# EAGLE schematic atx_psu_distributor_v2.0 (EAGLE 6.4)
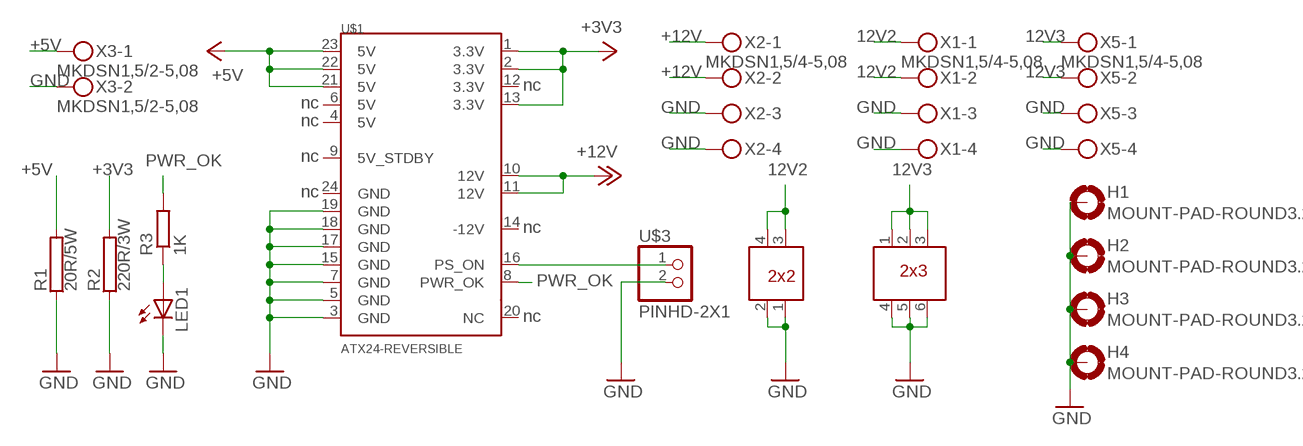
[diagram p0: schematic, sheet 1]

## Parts
H1  MOUNT-PAD-ROUND3.2  [3,2-PAD]
H2  MOUNT-PAD-ROUND3.2  [3,2-PAD]
H3  MOUNT-PAD-ROUND3.2  [3,2-PAD]
H4  MOUNT-PAD-ROUND3.2  [3,2-PAD]
LED1  LED3MM  [LED3MM]
R1  20R/5W  RHPS923  [HPS923]
R2  220R/3W  RCA4050  [CA4050]
R3  1K  R-EU_0207/10  [0207/10]
U$1  ATX24-REVERSIBLE  [ATX24]
U$2  ATX2X2  [ATX2X2]
U$3  PINHD-2X1  [PINHD-2X1]
U$4  ATX2X3  [ATX2X3]
X1  MKDSN1,5/4-5,08  [MKDSN1,5/4-5,08]
X2  MKDSN1,5/4-5,08  [MKDSN1,5/4-5,08]
X3  MKDSN1,5/2-5,08  [MKDSN1,5/2-5,08]
X5  MKDSN1,5/4-5,08  [MKDSN1,5/4-5,08]

## Nets
12V2: U$2.3 U$2.4 X1.1 X1.2
12V3: U$4.1 U$4.2 U$4.3 X5.1 X5.2
+3V3: R2.2 U$1.1(3.3V) U$1.2(3.3V) U$1.13(3.3V)
+5V: R1.2 U$1.21(5V) U$1.22(5V) U$1.23(5V) X3.1
+12V: U$1.10(12V) U$1.11(12V) X2.1 X2.2
GND: H1.B3,2(MOUNT) H2.B3,2(MOUNT) H3.B3,2(MOUNT) H4.B3,2(MOUNT) LED1.K(C) R1.1 R2.1 U$1.3(GND) U$1.5(GND) U$1.7(GND) U$1.15(GND) U$1.17(GND) U$1.18(GND) U$1.19(GND) U$2.1 U$2.2 U$3.2 U$4.4 U$4.5 U$4.6 X1.3 X1.4 X2.3 X2.4 X3.2 X5.3 X5.4
N$1: U$1.16(PS_ON) U$3.1
N$2: LED1.A R3.1
PWR_OK: R3.2 U$1.8(PWR_OK)
Unconnected: U$1.4(5V) U$1.6(5V) U$1.9(5V_STDBY) U$1.12(3.3V) U$1.14(-12V) U$1.20(NC) U$1.24(GND)

## Notes on the sheet
- nc
- nc
- nc
- nc
- nc
- nc
- nc

## Library data of the parts
H1-H4 = holes:MOUNT-PAD-ROUND: MOUNTING PAD, round
LED1 = led:LED: LED OSRAM: - CHIPLED LG R971, LG N971, LY N971, LG Q971, LY Q971, LO R971, LY R971 LH N974, LH R974 LS Q976, LO Q976, LY Q976 LO Q996 - Hyper CHIPLED LW Q18S LB Q993, LB Q99A, LB R99A - SideLED LS A670, LO A670, LY A670, LG A670, LP A670 LB A673, LV A673, LT A673, LW A673 LH A674 LY A675 LS A676, LA A676, LO A676, LY A676, LW A676 LS A679, LY A679, LG A679 - Hyper Micro SIDELED® LS Y876, LA Y876, LO Y876, LY Y876 LT Y87S - SmartLED LW L88C, LW L88S LB L89C, LB L89S, LG L890 LS L89K, LO L89K, LY L89K LS L896, LA L896, LO L896, LY L896 - TOPLED LS T670, LO T670, LY T670, LG T670, LP T670 LSG T670, LSP T670, LSY T670, LOP T670, LYG T670 LG T671, LOG T671, LSG T671 LB T673, LV T673, LT T673, LW T673 LH T674 LS T676, LA T676, LO T676, LY T676, LB T676, LH T676, LSB T676, LW T676 LB T67C, LV T67C, LT T67C, LS T67K, LO T67K, LY T67K, LW E67C LS E67B, LA E67B, LO E67B, LY E67B, LB E67C, LV E67C, LT E67C LW T67C LS T679, LY T679, LG T679 LS T770, LO T770, LY T770, LG T770, LP T770 LB T773, LV T773, LT T773, LW T773 LH T774 LS E675, LA E675, LY E675, LS T675 LS T776, LA T776, LO T776, LY T776, LB T776 LHGB T686 LT T68C, LB T68C - Hyper Mini TOPLED® LB M676 - Mini TOPLED Santana® LG M470 LS M47K, LO M47K, LY M47K Source: http://www.osram.convergy.de LUXEON: - LUMILED® LXK2-PW12-R00, LXK2-PW12-S00, LXK2-PW14-U00, LXK2-PW14-V00 LXK2-PM12-R00, LXK2-PM12-S00, LXK2-PM14-U00 LXK2-PE12-Q00, LXK2-PE12-R00, LXK2-PE12-S00, LXK2-PE14-T00, LXK2-PE14-U00 LXK2-PB12-K00, LXK2-PB12-L00, LXK2-PB12-M00, LXK2-PB14-N00, LXK2-PB14-P00, LXK2-PB14-Q00 LXK2-PR12-L00, LXK2-PR12-M00, LXK2-PR14-Q00, LXK2-PR14-R00 LXK2-PD12-Q00, LXK2-PD12-R00, LXK2-PD12-S00 LXK2-PH12-R00, LXK2-PH12-S00 LXK2-PL12-P00, LXK2-PL12-Q00, LXK2-PL12-R00 Source: www.luxeon.com KINGBRIGHT: KA-3528ASYC Source: www.kingbright.com
R1 R2 = resistor-power:R: Power Resitor; OC_FARNELL: unknown; OC_NEWARK: unknown
R3 = resistor:R-EU_: RESISTOR, European symbol
U$1 = SparkFun:ATX24-REVERSIBLE
U$2 = SparkFun:ATX2X2
U$3 = pinhead_2p:PINHD-2X1
U$4 = SparkFun:ATX2X3
X1 X2 X5 = con-phoenix-508:MKDSN1,5/4-5,08: MKDSN 1,5/ 4-5,08 Printklemme Nennstrom: 13,5 A Nennspannung: 250 V Rastermaß: 5,08 mm Polzahl: 4 Anschlussart: Schraubanschluss Montage: Löten Anschlussrichtung Leiter/Platine: 0 ° Artikelnummer: 1729144 Source: http://eshop.phoenixcontact.com .. 1729144.pdf; MPN: SMKDSN1,5/4-5,08; OC_FARNELL: 1792905; OC_NEWARK: 70R0300
X3 = con-phoenix-508:MKDSN1,5/2-5,08: MKDSN 1,5/ 2-5,08 Printklemme Nennstrom: 13,5 A Nennspannung: 250 V Rastermaß: 5,08 mm Polzahl: 2 Anschlussart: Schraubanschluss Montage: Löten Anschlussrichtung Leiter/Platine: 0 ° Artikelnummer: 1729128 Source: http://eshop.phoenixcontact.com .. 1729128.pdf; MPN: MKDSN 1,5/2-5.08; OC_FARNELL: 1792903; OC_NEWARK: 30M2397